# Altium schematic sheet STM32_IO.SchDoc: STM32_IO
size B; Organization: Myomo; Address3: USA; SheetNumber: 9
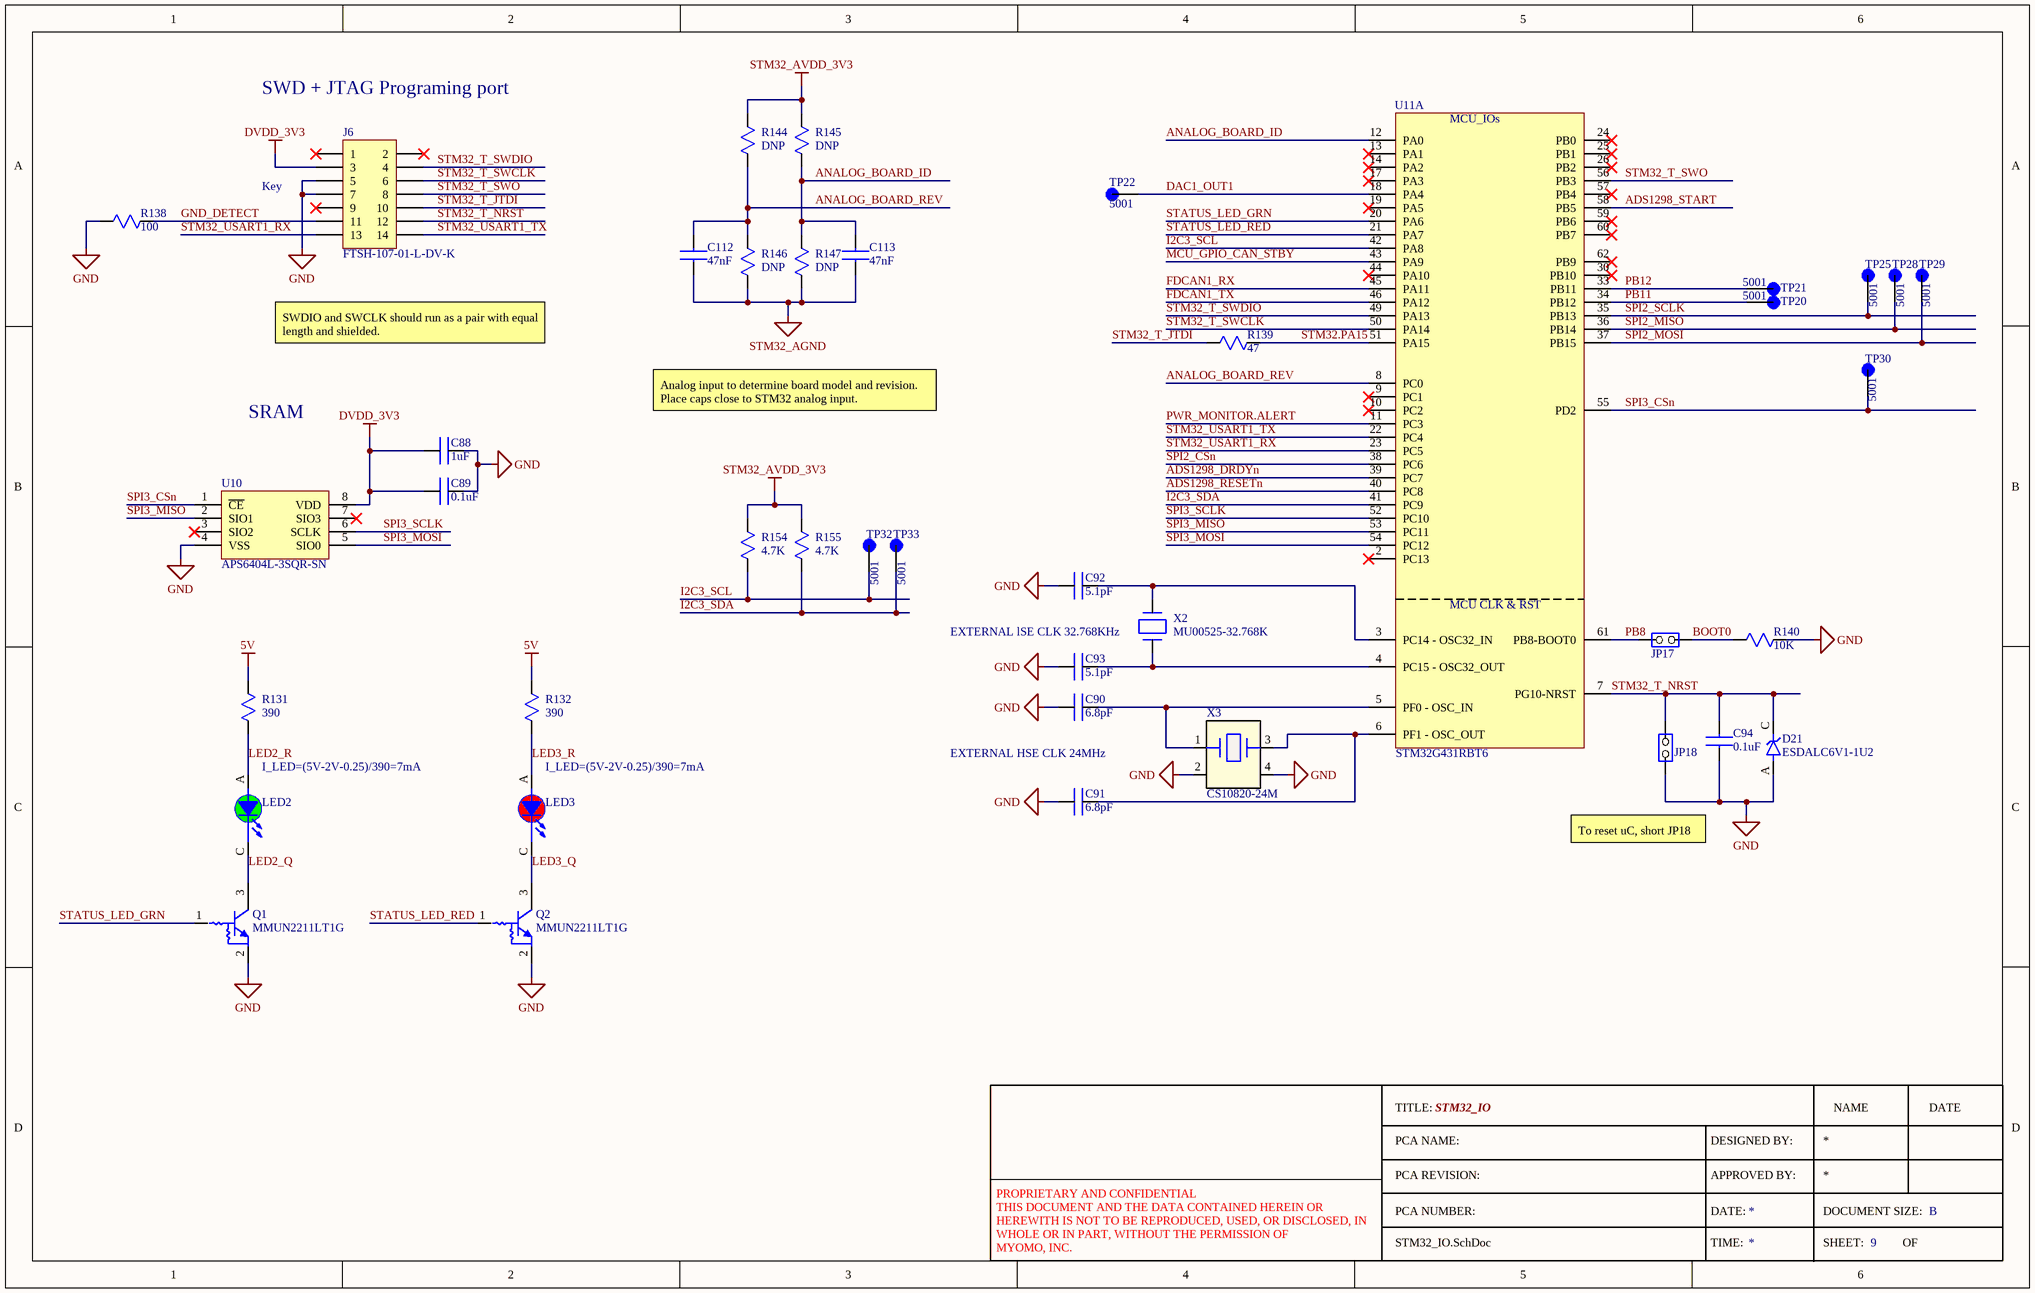
[diagram p0: STM32_IO.SchDoc]

## Parts
C88  1uF  [0603]
C89  0.1uF  [0402]
C90  6.8pF  [0402]
C91  6.8pF  [0402]
C92  5.1pF  [0402]
C93  5.1pF  [0402]
C94  0.1uF  [0402]
C112  47nF  [0402]
C113  47nF  [0402]
D21  ESDALC6V1-1U2  [D_TVS_6.1V_20W]
J6  FTSH-107-01-L-DV-K  [J_SAMTEC_FTSH-107-01-L-DV-K]
JP17  JP_1x2_TSW-102-07-F-S  [JP_1x2_TSW-102-07-F-S]  (value not drawn)
JP18  JP_1x2_TSW-102-07-F-S  [JP_1x2_TSW-102-07-F-S]  (value not drawn)
LED2  D_LED_GREEN_LTST  [D_LED_GREEN_LTST]  (value not drawn)
LED3  D_LED_RED_LTST  [D_LED_RED_LTST]  (value not drawn)
Q1  MMUN2211LT1G  [Q_NPN_PREBIAS_MMUN2211LT1G]
Q2  MMUN2211LT1G  [Q_NPN_PREBIAS_MMUN2211LT1G]
R131  390  [0603]
R132  390  [0603]
R138  100  [0402]
R139  47  [0402]
R140  10K  [0402]
R144  DNP  [0603]  (no BOM)
R145  DNP  [0603]  (no BOM)
R146  DNP  [0603]  (no BOM)
R147  DNP  [0603]  (no BOM)
R154  4.7K  [0402]
R155  4.7K  [0402]
TP20  5001  [TP_CLIP_BLK_5001]
TP21  5001  [TP_CLIP_BLK_5001]
TP22  5001  [TP_CLIP_BLK_5001]
TP25  5001  [TP_CLIP_BLK_5001]
TP28  5001  [TP_CLIP_BLK_5001]
TP29  5001  [TP_CLIP_BLK_5001]
TP30  5001  [TP_CLIP_BLK_5001]
TP32  5001  [TP_CLIP_BLK_5001]
TP33  5001  [TP_CLIP_BLK_5001]
U10  APS6404L-3SQR-SN  [U_APS6404L-3SQR-SN]
U11  STM32G431RBT6  [U_STM32G431R]  (part A of 2)
X2  MU00525-32.768K  [XTAL_32.768KHZ_20PPM]
X3  CS10820-24M  [XTAL_24.0000MHZ_15PPM]

## Nets
5V: R131.1 R132.1
DVDD_3V3: C88.1 C89.1 J6.3 U10.8(VDD)
GND: C88.2 C89.2 C90.1 C91.1 C92.1 C93.1 C94.2 D21.A J6.5 J6.7 JP18.1 Q1.2(E) Q2.2(E) R138.1 R140.2 U10.4(VSS) X3.2(X2) X3.4(X4)
STM32_AGND: C112.2 C113.2 R146.2 R147.2
STM32_AVDD_3V3: R144.1 R145.1 R154.1 R155.1
ADS1298_DRDYn: U11.39(PC7)
ADS1298_RESETn: U11.40(PC8)
ADS1298_START: U11.58(PB5)
ANALOG_BOARD_ID: C113.1 R145.2 R147.1 U11.12(PA0)
ANALOG_BOARD_REV: C112.1 R144.2 R146.1 U11.8(PC0)
BOOT0: JP17.2 R140.1
DAC1_OUT1: TP22.TP U11.18(PA4)
FDCAN1_RX: U11.45(PA11)
FDCAN1_TX: U11.46(PA12)
GND_DETECT: J6.11 R138.2
I2C3_SCL: R154.2 TP32.TP U11.42(PA8)
I2C3_SDA: R155.2 TP33.TP U11.41(PC9)
LED2_Q: LED2.C(CATHODE) Q1.3(C)
LED2_R: LED2.A(ANODE) R131.2
LED3_Q: LED3.C(CATHODE) Q2.3(C)
LED3_R: LED3.A(ANODE) R132.2
MCU_GPIO_CAN_STBY: U11.43(PA9)
PB8: JP17.1 U11.61(PB8-BOOT0)
PB11: TP20.TP U11.34(PB12)
PB12: TP21.TP U11.33(PB11)
PWR_MONITOR.ALERT: U11.11(PC3)
SPI2_CSn: U11.38(PC6)
SPI2_MISO: TP28.TP U11.36(PB14)
SPI2_MOSI: TP29.TP U11.37(PB15)
SPI2_SCLK: TP25.TP U11.35(PB13)
SPI3_CSn: TP30.TP U10.1(~{CE}) U11.55(PD2)
SPI3_MISO: U10.2(SIO1) U11.53(PC11)
SPI3_MOSI: U10.5(SIO0) U11.54(PC12)
SPI3_SCLK: U10.6(SCLK) U11.52(PC10)
STATUS_LED_GRN: Q1.1(B) U11.20(PA6)
STATUS_LED_RED: Q2.1(B) U11.21(PA7)
STM32.PA15: R139.2 U11.51(PA15)
STM32_T_JTDI: J6.10 R139.1
STM32_T_NRST: C94.1 D21.C J6.12 JP18.2 U11.7(PG10-NRST)
STM32_T_SWCLK: J6.6 U11.50(PA14)
STM32_T_SWDIO: J6.4 U11.49(PA13)
STM32_T_SWO: J6.8 U11.56(PB3)
STM32_USART1_RX: J6.13 U11.23(PC5)
STM32_USART1_TX: J6.14 U11.22(PC4)
NetC90_2: C90.2 U11.5(PF0_-_OSC_IN) X3.1(X1)
NetC91_2: C91.2 U11.6(PF1_-_OSC_OUT) X3.3(X3)
NetC92_2: C92.2 U11.3(PC14_-_OSC32_IN) X2.1(X1)
NetC93_2: C93.2 U11.4(PC15_-_OSC32_OUT) X2.2(X2)

Not connected (* = marked no-connect by the designer): J6 1* 2* 9*; U10 3(SIO2)* 7(SIO3)*; U11 2(PC13)* 9(PC1)* 10(PC2)* 13(PA1)* 14(PA2)* 17(PA3)* 19(PA5)* 24(PB0)* 25(PB1)* 26(PB2)* 30(PB10)* 44(PA10)* 57(PB4)* 59(PB6)* 60(PB7)* 62(PB9)*

## Notes on the sheet
- SWD + JTAG Programing port
- Key
- SWDIO and SWCLK should run as a pair with equal length and shielded.
- SRAM
- Analog input to determine board model and revision.
  Place caps close to STM32 analog input.
- EXTERNAL lSE CLK 32.768KHz
- (near LED2) I_LED=(5V-2V-0.25)/390=7mA
- (near LED3) I_LED=(5V-2V-0.25)/390=7mA
- EXTERNAL HSE CLK 24MHz
- To reset uC, short JP18
- TITLE:
- NAME
- DATE
- PCA REVISION:
- PCA NAME:
- APPROVED BY:
- DESIGNED BY:
- PCA NUMBER:
- DATE:
- TIME:
- DOCUMENT SIZE:
- SHEET:
- OF
- B
- PROPRIETARY AND CONFIDENTIAL
  THIS DOCUMENT AND THE DATA CONTAINED HEREIN OR HEREWITH IS NOT TO BE REPRODUCED, USED, OR DISCLOSED, IN WHOLE OR IN PART, WITHOUT THE PERMISSION OF
  MYOMO, INC.
- (in symbol U_STM32G431R, part A) MCU_IOs; MCU CLK & RST

## Library data of the parts
C88 = C_0603_CER_1uF_50V_X7R: CAP CER 1UF 50V X7R 0603; MFG: YAGEO; MFGPN: CC0603KRX7R9BB105; Myomo PN: 201-0006
C89 C94 = C_0402_CER_0.1uF_50V_X7R: CAP CER 0.1UF 50V X7R 0402; MFG: Samsung; MFGPN: CL05B104KB54PNC; Myomo PN: 201-0017
C90 C91 = C_0402_CER_6.8pF_50V_COG: CAP CER 6.8PF 50V C0G/NPO 0402; MFG: YAGEO; MFGPN: CC0402CRNPO9BN6R8; Myomo PN: 201-0015
C92 C93 = C_0402_CER_5.1pF_50V_COG: CAP CER 5.1PF 50V C0G/NPO 0402; MFG: YAGEO; MFGPN: CC0402CRNPO9BN5R1; Myomo PN: 201-0016
C112 C113 = C_0402_CER_47nF_50V_X7R: CAP CER 47nF 50V X7R 0402; MFG: TDK; MFGPN: CGA2B3X7R1H473K050BB; Myomo PN: 201-0018
D21 = D_TVS_6.1V_20W: TVS DIODE 3VRS ST 0201; MFG: STMicroelectronics; Myomo PN: 203-0007; MFGPN: ESDALC6V1-1U2
J6 = J_SAMTEC_FTSH-107-01-L-DV-K: CONN HEADER SMD 14POS 1.27MM; MFG: Samtec; Myomo PN: 211-0010; MFGPN: FTSH-107-01-L-DV-K; ComponentLink1Description: New link; ComponentLink1URL: *
JP17 JP18 = JP_1x2_TSW-102-07-F-S: CONN HEADER VERT 2POS 2.54MM; MFG: SAMTEC; Myomo PN: 214-0001; MFGPN: TSW-102-07-F-S
LED2 = D_LED_GREEN_LTST: LED GREEN CLEAR 0603 SMD; Myomo PN: 203-0004; MFG: Lite-On Inc.; MFGPN: LTST-C191KGKT; Supplier 1: Digi-Key; Supplier Part Number 1: 160-1446-1-ND
LED3 = D_LED_RED_LTST: LED RED CLEAR SMD; Myomo PN: 203-0005; MFG: Lite-On Inc.; MFGPN: LTST-C191KRKT; Supplier 1: Digi-Key; Supplier Part Number 1: 160-1447-1-ND
Q1 Q2 = Q_NPN_PREBIAS_MMUN2211LT1G: TRANS PREBIAS NPN 246MW SOT23-3; MFG: ON Semiconductor; Myomo PN: 208-0001; Supplier 1: Digi-Key; MFGPN: MMUN2211LT1G; Supplier Part Number 1: MMUN2211LT1GOSCT-ND
R131 R132 = R_0603_390_1%_1/10W: RES 390 OHM 1% 1/10W 0603; MFG: YAGEO; MFGPN: RC0603FR-07390RL; Myomo PN: 200-0017
R138 = R_0402_100_1%_1/10W: RES SMD 100 OHM 1% 1/10W 0402; MFG: Panasonic; MFGPN: ERJ-2RKF1000X; Myomo PN: 200-0019
R139 = R_0402_47_1%_1/10W: RES SMD 47 OHM 1% 1/10W 0402; MFG: Panasonic; MFGPN: ERJ-2RKF47R0X; Myomo PN: 200-0020
R140 = R_0402_10K_1%_1/10W: RES SMD 10K OHM 1% 1/10W 0402; MFG: Panasonic; MFGPN: ERJ-2RKF1002X; Myomo PN: 200-0021
R144-R147 = R_0603_DNP: RES 0603 DNP
R154 R155 = R_0402_4.7K_1%_1/10W: RES SMD 4.7K OHM 1% 1/10W 0402; MFG: Panasonic; MFGPN: ERJ-2RKF4701X; Myomo PN: 200-0022
TP20-TP22 TP25 TP28-TP30 TP32 TP33 = TP_CLIP_BLK_5001: PC TEST POINT MINIATURE BLACK; MFG: Keystone Electronics; Myomo PN: 213-0001; MFGPN: 5001
U10 = U_APS6404L-3SQR-SN: DRAM IoT RAM 64Mb QSPI (x1,x4) SDR 133/84MHz, RBX, 3V, Ind. Temp., SOP8; MFG: AP Memory; Myomo PN: 204-0011; MFGPN: APS6404L-3SQR-SN; Supplier 1: Mouser; Supplier Part Number 1: 878-APS6404L-3SQR-SN; ComponentLink1Description: schematics link; ComponentLink1URL: https://download.mikroe.com/documents/add-on-boards/click/DRAM_click/DRAM_click_v100_Schematic.PDF
U11 = U_STM32G431R: STM32G431, LQFP64 package; MFG: STMicroelectronics; Myomo PN: 204-0012; MFGPN: STM32G431RBT6
X2 = XTAL_32.768KHZ_20PPM: XTAL OSC 32.7680KHZ 6PF SMD; MFG: NDK; Myomo PN: 205-0002; MFGPN: MU00525-32.768K; Supplier 1: Digikey; Supplier Part Number 1: 644-MU00525-32.768KCT-ND
X3 = XTAL_24.0000MHZ_15PPM: XTAL OSC 24 MHz ±15ppm Crystal 6pF 80 Ohms 4-SMD, No Lead; MFG: NDK; Myomo PN: 205-0003; MFGPN: CS10820-24M; Supplier 1: Digikey; Supplier Part Number 1: 644-CS10820-24MCT-ND